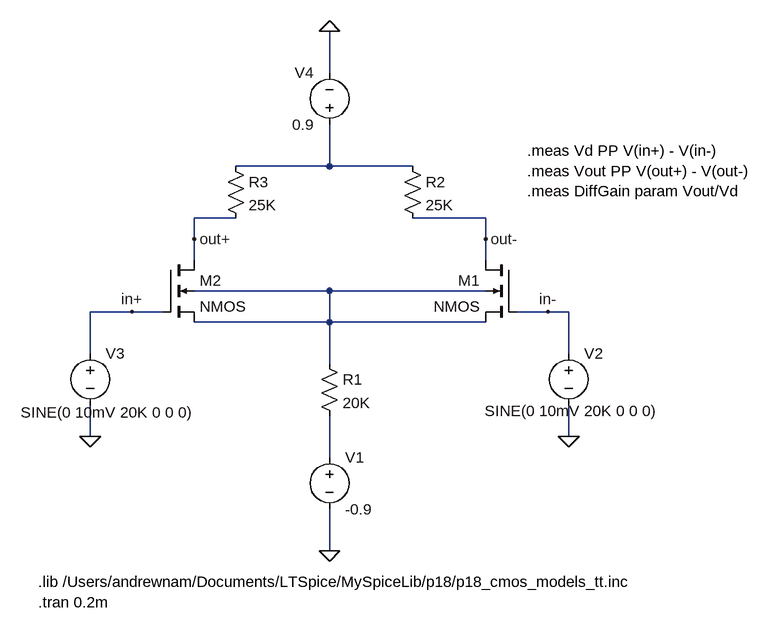
[diagram p0: schematic fig08_differential_pair.asc]
fig08_differential_pair.asc, the LTspice schematic file:
Version 4
SHEET 1 1128 692
WIRE 432 -128 432 -192
WIRE 432 16 432 -48
WIRE 432 16 288 16
WIRE 560 16 432 16
WIRE 288 96 224 96
WIRE 672 96 560 96
WIRE 224 128 224 96
WIRE 672 128 672 96
WIRE 224 160 224 128
WIRE 672 160 672 128
WIRE 432 208 224 208
WIRE 672 208 432 208
WIRE 128 240 64 240
WIRE 176 240 128 240
WIRE 768 240 720 240
WIRE 800 240 768 240
WIRE 432 256 432 208
WIRE 432 256 224 256
WIRE 672 256 432 256
WIRE 64 304 64 240
WIRE 800 304 800 240
WIRE 432 320 432 256
WIRE 64 432 64 384
WIRE 800 432 800 384
WIRE 432 464 432 400
WIRE 432 608 432 544
FLAG 432 608 0
FLAG 800 432 0
FLAG 64 432 0
FLAG 432 -192 0
FLAG 128 240 in+
FLAG 768 240 in-
FLAG 224 128 out+
FLAG 672 128 out-
SYMBOL voltage 432 448 R0
SYMATTR InstName V1
SYMATTR Value -0.9
SYMBOL res 416 304 R0
SYMATTR InstName R1
SYMATTR Value 20K
SYMBOL nmos4 720 160 M0
SYMATTR InstName M1
SYMATTR Value2 l=0.18u w=10u
SYMBOL nmos4 176 160 R0
SYMATTR InstName M2
SYMATTR Value2 l=0.18 w=10u
SYMBOL voltage 800 288 R0
WINDOW 3 -129 105 Left 2
SYMATTR InstName V2
SYMATTR Value SINE(0 10mV 20K 0 0 0)
SYMBOL voltage 64 288 R0
WINDOW 3 -107 107 Left 2
SYMATTR InstName V3
SYMATTR Value SINE(0 10mV 20K 0 0 0)
SYMBOL voltage 432 -32 R180
WINDOW 0 24 96 Left 2
WINDOW 3 24 16 Left 2
SYMATTR InstName V4
SYMATTR Value 0.9
SYMBOL res 544 0 R0
SYMATTR InstName R2
SYMATTR Value 25K
SYMBOL res 272 0 R0
SYMATTR InstName R3
SYMATTR Value 25K
TEXT -16 656 Left 2 !.lib /Users/andrewnam/Documents/LTSpice/MySpiceLib/p18/p18_cmos_models_tt.inc\n.tran 0.2m
TEXT 736 -8 Left 2 !.meas Vd PP V(in+) - V(in-)\n.meas Vout PP V(out+) - V(out-)\n.meas DiffGain param Vout/Vd

The netlist it stands for:
* fig08_differential_pair.asc
V1 N003 0 -0.9
R1 N002 N003 20K
M1 out- in- N002 N002 NMOS l=0.18u w=10u
M2 out+ in+ N002 N002 NMOS l=0.18 w=10u
V2 in- 0 SINE(0 10mV 20K 0 0 0)
V3 in+ 0 SINE(0 10mV 20K 0 0 0)
V4 N001 0 0.9
R2 N001 out- 25K
R3 N001 out+ 25K
.model NMOS NMOS
.model PMOS PMOS
.lib standard.mos
.lib /Users/andrewnam/Documents/LTSpice/MySpiceLib/p18/p18_cmos_models_tt.inc
.tran 0.2m
.meas Vd PP V(in+) - V(in-)
.meas Vout PP V(out+) - V(out-)
.meas DiffGain param Vout/Vd
.backanno
.end